# Altium schematic sheet openEPS.SchDoc: OCP EPS Board
size Tabloid; SheetNumber: 1
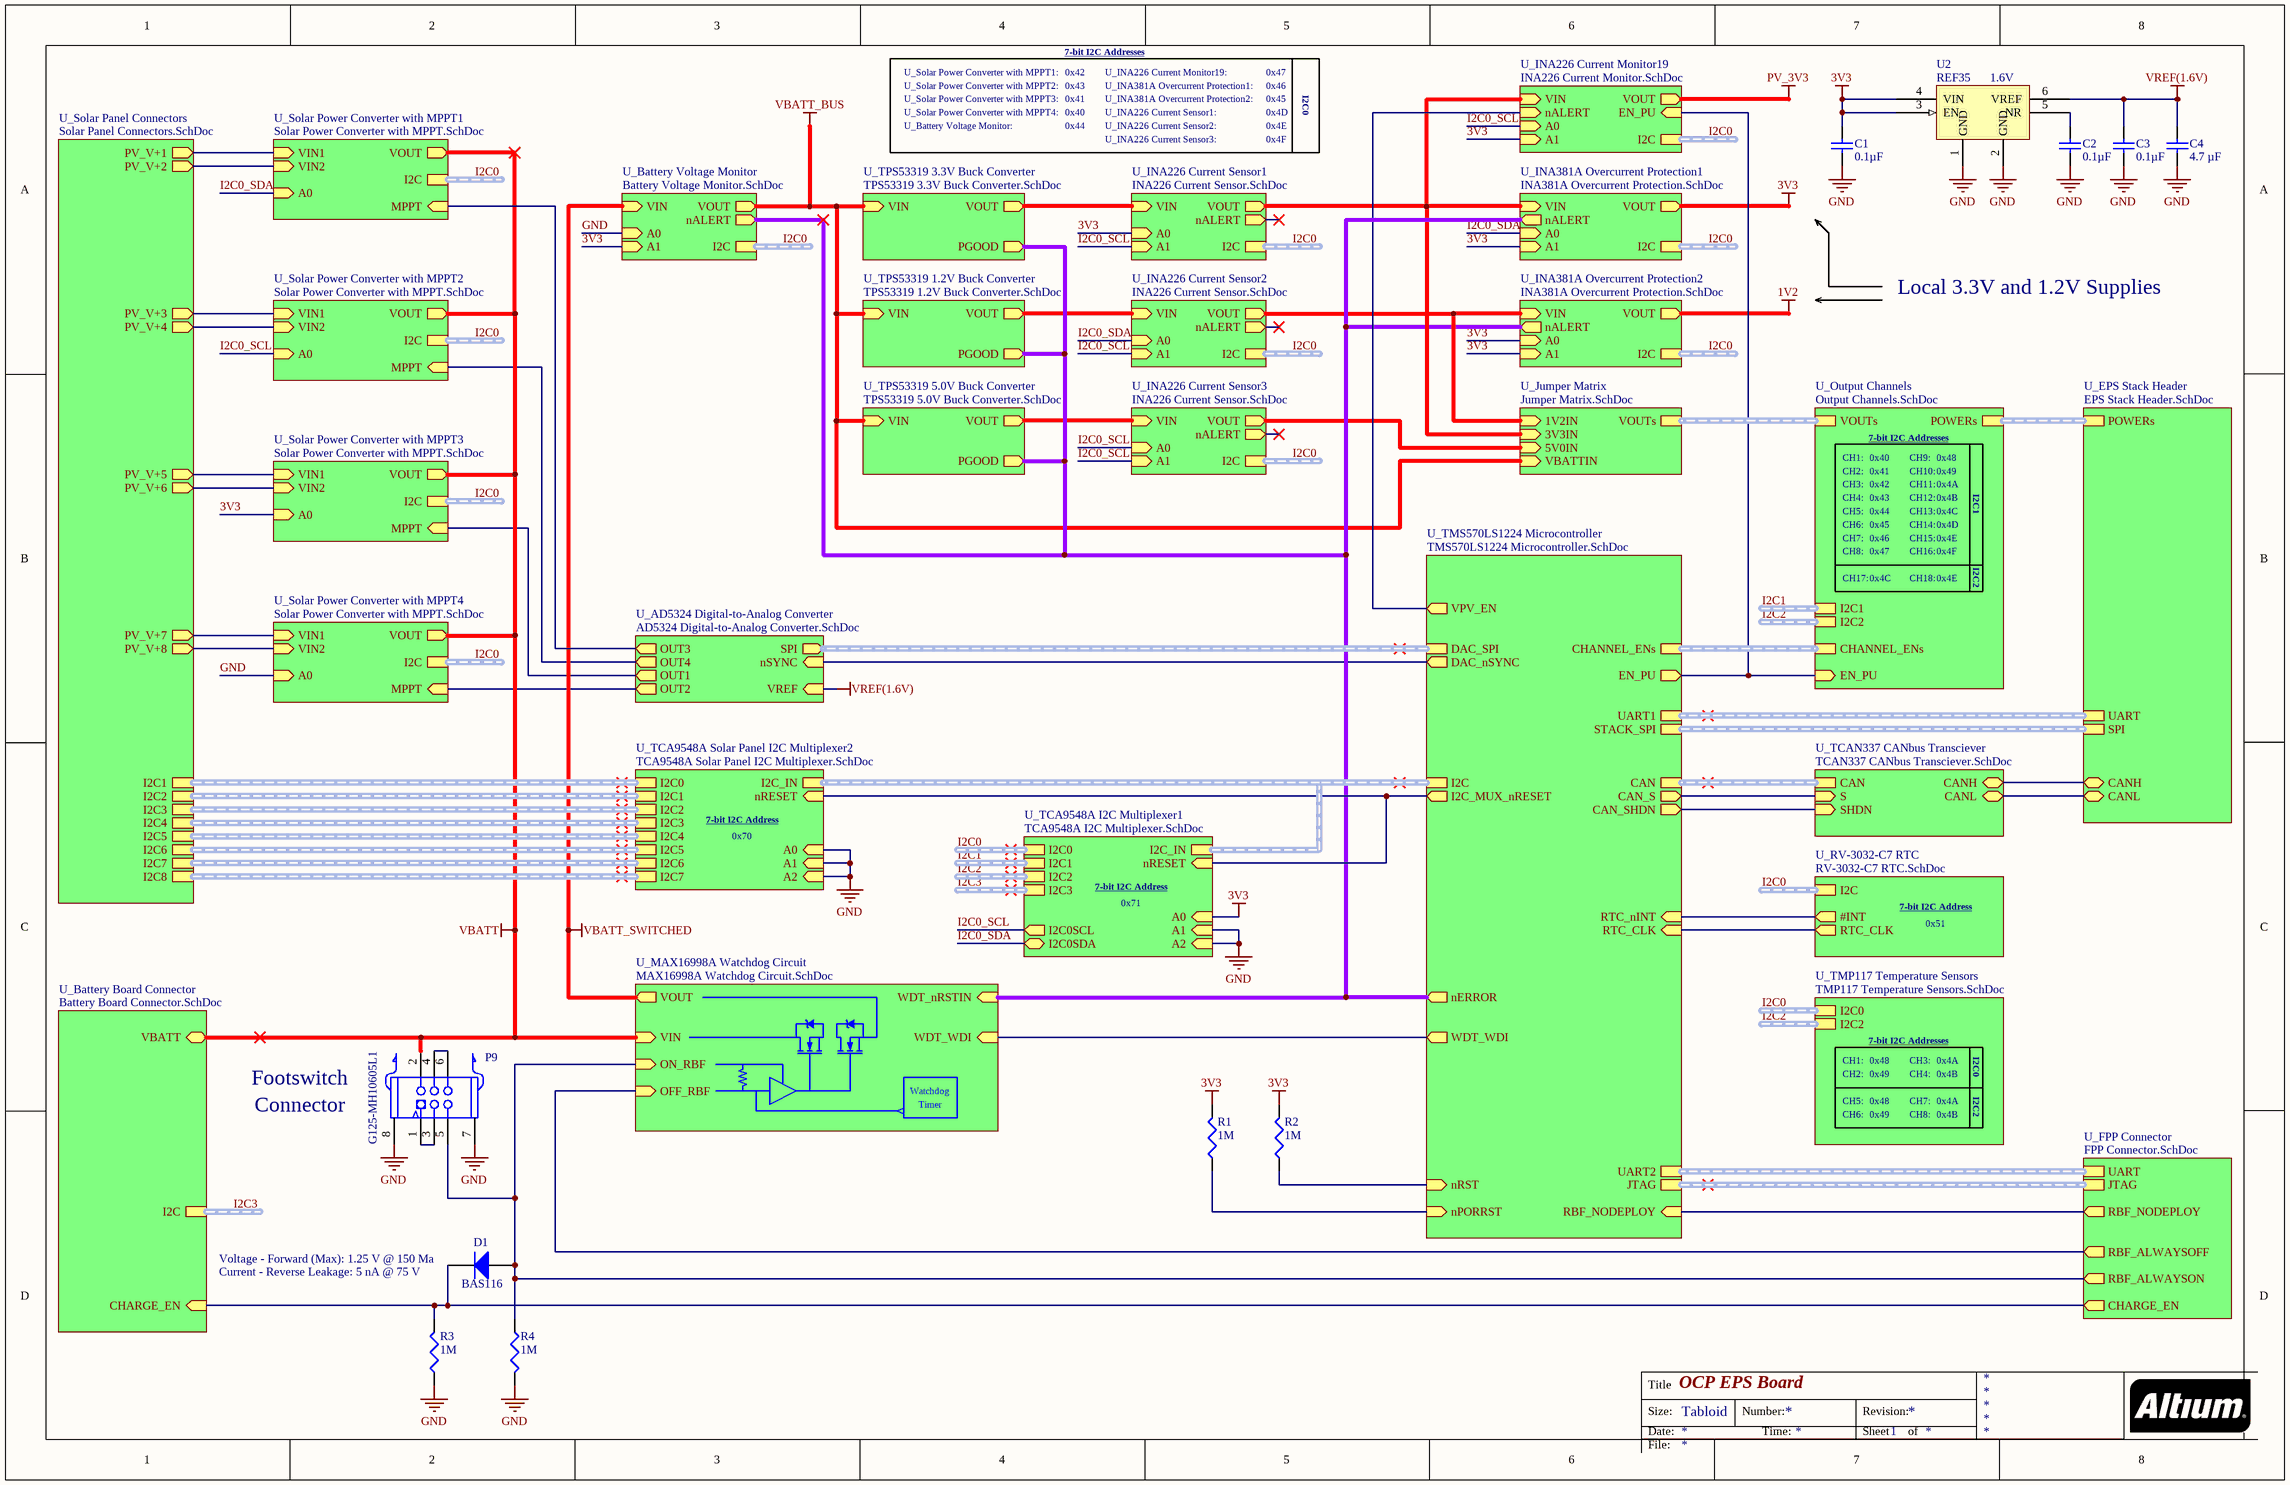
[diagram p0: openEPS.SchDoc]

## Parts
C1  value 0.1µF  [TDK-CGA2B]  (hidden comment: Cap)
C2  value 0.1µF  [TDK-CGA2B]  (hidden comment: Cap)
C3  value 0.1µF  [TDK-CGA2B]  (hidden comment: Cap)
C4  value 4.7 µF  [MUR-GRM188]  (hidden comment: Cap)
D1  BAS116  Voltage - Forward (Max): 1.25 V @ 150 Ma  Current - Reverse Leakage: 5 nA @ 75 V  [DIOD-DFN1006-2]
P9  G125-MH10605L1  [HWN-G125-MH10605L1]
R1  value 1M  [PANA-ERJ2R]  (hidden comment: Res3)
R2  value 1M  [PANA-ERJ2R]  (hidden comment: Res3)
R3  value 1M  [PANA-ERJ2R]  (hidden comment: Res3)
R4  value 1M  [PANA-ERJ2R]  (hidden comment: Res3)
U2  REF35  value 1.6V  [TI-DBV0006A]

## Sub-sheets
U_AD5324 Digital-to-Analog Converter = AD5324 Digital-to-Analog Converter.SchDoc: SPI (out, harness AD5324_SPI), OUT1 (out), OUT2 (out), nSYNC (in), OUT3 (out), OUT4 (out), VREF (in)
U_Battery Board Connector = Battery Board Connector.SchDoc: CHARGE_EN (in), I2C (harness TMS570_I2C1), VBATT (bidir)
U_Battery Voltage Monitor = Battery Voltage Monitor.SchDoc: VIN (in), VOUT (out), I2C (harness INA226_I2C), A0 (in), A1 (in), nALERT (out)
U_EPS Stack Header = EPS Stack Header.SchDoc: CANH (bidir), CANL (bidir), SPI (harness STACK_SPI), UART (harness STACK_UART), POWERs (harness POWERs)
U_FPP Connector = FPP Connector.SchDoc: JTAG (harness DEBUG_JTAG), RBF_ALWAYSON (out), RBF_ALWAYSOFF (out), RBF_NODEPLOY (out), CHARGE_EN (out), UART (harness UART)
U_INA226 Current Monitor19 = INA226 Current Monitor.SchDoc: VIN (in), VOUT (out), I2C (harness I2C), A0 (in), A1 (in), nALERT (in), EN_PU (in)
U_INA226 Current Sensor1 = INA226 Current Sensor.SchDoc: VIN (in), VOUT (out), I2C (harness I2C), A0 (in), A1 (in), nALERT (out)
U_INA226 Current Sensor2 = INA226 Current Sensor.SchDoc: VIN (in), VOUT (out), I2C (harness I2C), A0 (in), A1 (in), nALERT (out)
U_INA226 Current Sensor3 = INA226 Current Sensor.SchDoc: VIN (in), VOUT (out), I2C (harness INA226_I2C), A0 (in), A1 (in), nALERT (out)
U_INA381A Overcurrent Protection1 = INA381A Overcurrent Protection.SchDoc: VIN (in), VOUT (out), I2C (harness I2C), A0 (in), A1 (in), nALERT (out)
U_INA381A Overcurrent Protection2 = INA381A Overcurrent Protection.SchDoc: VIN (in), VOUT (out), I2C (harness INA226_I2C), A0 (in), A1 (in), nALERT (out)
U_Jumper Matrix = Jumper Matrix.SchDoc: 3V3IN (in), VBATTIN (in), 1V2IN (in), 5V0IN (in), VOUTs (harness VOUTs)
U_MAX16998A Watchdog Circuit = MAX16998A Watchdog Circuit.SchDoc: WDT_WDI (in), WDT_nRSTIN (in), ON_RBF (in), VOUT (out), VIN (in), OFF_RBF (in)
U_Output Channels = Output Channels.SchDoc: CHANNEL_ENs (harness CHANNEL_ENs), VOUTs (harness VOUTs), POWERs (harness POWERs), EN_PU (in), I2C2 (harness LTC4316_I2CIN), I2C1 (harness LTC4316_I2CIN)
U_RV-3032-C7 RTC = RV-3032-C7 RTC.SchDoc: #INT (out), I2C (harness RTCMK_I2C), RTC_CLK (out)
U_Solar Panel Connectors = Solar Panel Connectors.SchDoc: PV_V+1 (out), I2C1 (harness PV_I2C1), I2C2 (harness PV_I2C2), I2C3 (harness PV_I2C3), I2C4 (harness PV_I2C4), I2C5 (harness PV_I2C5), I2C6 (harness PV_I2C6), I2C7 (harness PV_I2C7), I2C8 (harness PV_I2C8), PV_V+2 (out), PV_V+3 (out), PV_V+4 (out), PV_V+5 (out), PV_V+6 (out), PV_V+7 (out), PV_V+8 (out)
U_Solar Power Converter with MPPT1 = Solar Power Converter with MPPT.SchDoc: VIN1 (in), VOUT (out), I2C (harness I2C), A0 (in), MPPT (in), VIN2 (in)
U_Solar Power Converter with MPPT2 = Solar Power Converter with MPPT.SchDoc: VIN1 (in), VOUT (out), I2C (harness I2C), A0 (in), MPPT (in), VIN2 (in)
U_Solar Power Converter with MPPT3 = Solar Power Converter with MPPT.SchDoc: VIN1 (in), VOUT (out), I2C (harness I2C), A0 (in), MPPT (in), VIN2 (in)
U_Solar Power Converter with MPPT4 = Solar Power Converter with MPPT.SchDoc: VIN1 (in), VOUT (out), I2C (harness INA3221_I2C), A0 (in), MPPT (in), VIN2 (in)
U_TCA9548A I2C Multiplexer1 = TCA9548A I2C Multiplexer.SchDoc: I2C1 (harness TCA9548A_I2C1), I2C2 (harness TCA9548A_I2C2), I2C3 (harness TCA9548A_I2C3), I2C_IN (harness TCA9548A_I2CIN), I2C0 (harness TCA9548A_I2C0), A0 (in), A1 (in), A2 (in), nRESET (in), I2C0SCL (out), I2C0SDA (bidir)
U_TCA9548A Solar Panel I2C Multiplexer2 = TCA9548A Solar Panel I2C Multiplexer.SchDoc: I2C1 (harness TCA9548A_I2C1), I2C2 (harness TCA9548A_I2C2), I2C3 (harness TCA9548A_I2C3), I2C4 (harness TCA9548A_I2C4), I2C5 (harness TCA9548A_I2C5), I2C6 (harness TCA9548A_I2C6), I2C7 (harness TCA9548A_I2C7), I2C_IN (harness TCA9548A_I2CIN), I2C0 (harness TCA9548A_I2C0), A0 (in), A1 (in), A2 (in), nRESET (in)
U_TCAN337 CANbus Transciever = TCAN337 CANbus Transciever.SchDoc: CANH (bidir), CANL (bidir), CAN (harness TCAN337_CAN), S (in), SHDN (in)
U_TMP117 Temperature Sensors = TMP117 Temperature Sensors.SchDoc: I2C0 (harness TCA9548A_I2CIN), I2C2 (harness TCA9548A_I2CIN)
U_TMS570LS1224 Microcontroller = TMS570LS1224 Microcontroller.SchDoc: nERROR (out), JTAG (harness TMS570_JTAG), CHANNEL_ENs (harness CHANNEL_ENs), DAC_nSYNC (out), WDT_WDI (out), VPV_EN (out), RTC_nINT (in), I2C (harness I2C), UART1 (harness UART), CAN (harness CAN), STACK_SPI (harness STACK_SPI), DAC_SPI (harness DAC_SPI), nRST (in), RTC_CLK (in), CAN_SHDN (out), CAN_S (out), nPORRST (in), RBF_NODEPLOY (in), EN_PU (out), UART2 (harness UART), I2C_MUX_nRESET (out)
U_TPS53319 1.2V Buck Converter = TPS53319 1.2V Buck Converter.SchDoc: VIN (in), VOUT (out), PGOOD (out)
U_TPS53319 3.3V Buck Converter = TPS53319 3.3V Buck Converter.SchDoc: VIN (in), VOUT (out), PGOOD (out)
U_TPS53319 5.0V Buck Converter = TPS53319 5.0V Buck Converter.SchDoc: VIN (in), VOUT (out), PGOOD (out)

## Nets
1V2: sheet U_INA381A Overcurrent Protection2/VOUT
3V3: C1.1 R1.1 R2.1 U2.3(EN) U2.4(VIN) ; sheet U_INA381A Overcurrent Protection2/A0, sheet U_INA381A Overcurrent Protection2/A1, sheet U_INA381A Overcurrent Protection1/VOUT, sheet U_INA381A Overcurrent Protection1/A1, sheet U_INA226 Current Monitor19/A1, sheet U_INA226 Current Sensor1/A0, sheet U_Solar Power Converter with MPPT3/A0, sheet U_Battery Voltage Monitor/A1, sheet U_TCA9548A I2C Multiplexer1/A0
GND: C1.2 C2.2 C3.2 C4.1 P9.7 P9.8 R3.1 R4.2 U2.1(GND) U2.2(GND) ; sheet U_TCA9548A Solar Panel I2C Multiplexer2/A0, sheet U_TCA9548A Solar Panel I2C Multiplexer2/A1, sheet U_TCA9548A Solar Panel I2C Multiplexer2/A2, sheet U_Solar Power Converter with MPPT4/A0, sheet U_Battery Voltage Monitor/A0, sheet U_TCA9548A I2C Multiplexer1/A1, sheet U_TCA9548A I2C Multiplexer1/A2
PV_3V3: sheet U_INA226 Current Monitor19/VOUT
VBATT: P9.2 ; sheet U_MAX16998A Watchdog Circuit/VIN, sheet U_Solar Power Converter with MPPT1/VOUT, sheet U_Solar Power Converter with MPPT2/VOUT, sheet U_Solar Power Converter with MPPT3/VOUT, sheet U_Solar Power Converter with MPPT4/VOUT, sheet U_Battery Board Connector/VBATT
VBATT_BUS: sheet U_Jumper Matrix/VBATTIN, sheet U_TPS53319 1.2V Buck Converter/VIN, sheet U_TPS53319 3.3V Buck Converter/VIN, sheet U_TPS53319 5.0V Buck Converter/VIN, sheet U_Battery Voltage Monitor/VOUT
VBATT_SWITCHED: sheet U_MAX16998A Watchdog Circuit/VOUT, sheet U_Battery Voltage Monitor/VIN
VREF(1.6V): C3.1 C4.2 U2.6(VREF) ; sheet U_AD5324 Digital-to-Analog Converter/VREF
I2C0_SCL: sheet U_INA226 Current Monitor19/A0, sheet U_INA226 Current Sensor1/A1, sheet U_INA226 Current Sensor2/A1, sheet U_INA226 Current Sensor3/A0, sheet U_INA226 Current Sensor3/A1, sheet U_Solar Power Converter with MPPT2/A0, sheet U_TCA9548A I2C Multiplexer1/I2C0SCL
I2C0_SDA: sheet U_INA381A Overcurrent Protection1/A0, sheet U_INA226 Current Sensor2/A0, sheet U_Solar Power Converter with MPPT1/A0, sheet U_TCA9548A I2C Multiplexer1/I2C0SDA
NetC2_1: C2.1 U2.5(NR)
NetD1_1: D1.1(A) P9.5 R4.1 ; sheet U_MAX16998A Watchdog Circuit/ON_RBF, sheet U_FPP Connector/RBF_ALWAYSON
NetD1_2: D1.2(K) R3.2 ; sheet U_FPP Connector/CHARGE_EN, sheet U_Battery Board Connector/CHARGE_EN
NetP9_1: P9.1 P9.3
NetP9_4: P9.4 P9.6
NetR1_2: R1.2 ; sheet U_TMS570LS1224 Microcontroller/nPORRST
NetR2_2: R2.2 ; sheet U_TMS570LS1224 Microcontroller/nRST
(unnamed): sheet U_Output Channels/EN_PU, sheet U_INA226 Current Monitor19/EN_PU, sheet U_TMS570LS1224 Microcontroller/EN_PU
(unnamed): sheet U_Jumper Matrix/3V3IN, sheet U_INA381A Overcurrent Protection1/VIN, sheet U_INA226 Current Monitor19/VIN, sheet U_INA226 Current Sensor1/VOUT
(unnamed): sheet U_Jumper Matrix/1V2IN, sheet U_INA381A Overcurrent Protection2/VIN, sheet U_INA226 Current Sensor2/VOUT
(unnamed): sheet U_Jumper Matrix/5V0IN, sheet U_INA226 Current Sensor3/VOUT
(unnamed): sheet U_TCAN337 CANbus Transciever/CANH, sheet U_EPS Stack Header/CANH
(unnamed): sheet U_TCAN337 CANbus Transciever/CANL, sheet U_EPS Stack Header/CANL
(unnamed): sheet U_TCAN337 CANbus Transciever/S, sheet U_TMS570LS1224 Microcontroller/CAN_S
(unnamed): sheet U_TCAN337 CANbus Transciever/SHDN, sheet U_TMS570LS1224 Microcontroller/CAN_SHDN
(unnamed): sheet U_INA381A Overcurrent Protection2/nALERT, sheet U_INA381A Overcurrent Protection1/nALERT, sheet U_TPS53319 1.2V Buck Converter/PGOOD, sheet U_TPS53319 3.3V Buck Converter/PGOOD, sheet U_TPS53319 5.0V Buck Converter/PGOOD, sheet U_MAX16998A Watchdog Circuit/WDT_nRSTIN, sheet U_TMS570LS1224 Microcontroller/nERROR, sheet U_Battery Voltage Monitor/nALERT
(unnamed): sheet U_INA226 Current Monitor19/nALERT, sheet U_TMS570LS1224 Microcontroller/VPV_EN
(unnamed): sheet U_AD5324 Digital-to-Analog Converter/OUT1, sheet U_Solar Power Converter with MPPT3/MPPT
(unnamed): sheet U_AD5324 Digital-to-Analog Converter/OUT2, sheet U_Solar Power Converter with MPPT4/MPPT
(unnamed): sheet U_AD5324 Digital-to-Analog Converter/nSYNC, sheet U_TMS570LS1224 Microcontroller/DAC_nSYNC
(unnamed): sheet U_AD5324 Digital-to-Analog Converter/OUT3, sheet U_Solar Power Converter with MPPT1/MPPT
(unnamed): sheet U_AD5324 Digital-to-Analog Converter/OUT4, sheet U_Solar Power Converter with MPPT2/MPPT
(unnamed): sheet U_TPS53319 1.2V Buck Converter/VOUT, sheet U_INA226 Current Sensor2/VIN
(unnamed): sheet U_TPS53319 3.3V Buck Converter/VOUT, sheet U_INA226 Current Sensor1/VIN
(unnamed): sheet U_TPS53319 5.0V Buck Converter/VOUT, sheet U_INA226 Current Sensor3/VIN
(unnamed): sheet U_MAX16998A Watchdog Circuit/WDT_WDI, sheet U_TMS570LS1224 Microcontroller/WDT_WDI
(unnamed): sheet U_MAX16998A Watchdog Circuit/OFF_RBF, sheet U_FPP Connector/RBF_ALWAYSOFF
(unnamed): sheet U_RV-3032-C7 RTC/#INT, sheet U_TMS570LS1224 Microcontroller/RTC_nINT
(unnamed): sheet U_RV-3032-C7 RTC/RTC_CLK, sheet U_TMS570LS1224 Microcontroller/RTC_CLK
(unnamed): sheet U_TCA9548A Solar Panel I2C Multiplexer2/nRESET, sheet U_TMS570LS1224 Microcontroller/I2C_MUX_nRESET, sheet U_TCA9548A I2C Multiplexer1/nRESET
(unnamed): sheet U_Solar Panel Connectors/PV_V+1, sheet U_Solar Power Converter with MPPT1/VIN1
(unnamed): sheet U_Solar Panel Connectors/PV_V+2, sheet U_Solar Power Converter with MPPT1/VIN2
(unnamed): sheet U_Solar Panel Connectors/PV_V+3, sheet U_Solar Power Converter with MPPT2/VIN1
(unnamed): sheet U_Solar Panel Connectors/PV_V+4, sheet U_Solar Power Converter with MPPT2/VIN2
(unnamed): sheet U_Solar Panel Connectors/PV_V+5, sheet U_Solar Power Converter with MPPT3/VIN1
(unnamed): sheet U_Solar Panel Connectors/PV_V+6, sheet U_Solar Power Converter with MPPT3/VIN2
(unnamed): sheet U_Solar Panel Connectors/PV_V+7, sheet U_Solar Power Converter with MPPT4/VIN1
(unnamed): sheet U_Solar Panel Connectors/PV_V+8, sheet U_Solar Power Converter with MPPT4/VIN2
(unnamed): sheet U_TMS570LS1224 Microcontroller/RBF_NODEPLOY, sheet U_FPP Connector/RBF_NODEPLOY

## Buses and harness runs
harness I2C0 = sheet U_Battery Voltage Monitor/I2C
harness I2C0 = sheet U_INA226 Current Monitor19/I2C
harness I2C0 = sheet U_INA226 Current Sensor1/I2C
harness I2C0 = sheet U_INA226 Current Sensor2/I2C
harness I2C0 = sheet U_INA226 Current Sensor3/I2C
harness I2C0 = sheet U_INA381A Overcurrent Protection1/I2C
harness I2C0 = sheet U_INA381A Overcurrent Protection2/I2C
harness I2C0 = sheet U_RV-3032-C7 RTC/I2C
harness I2C0 = sheet U_Solar Power Converter with MPPT1/I2C
harness I2C0 = sheet U_Solar Power Converter with MPPT2/I2C
harness I2C0 = sheet U_Solar Power Converter with MPPT3/I2C
harness I2C0 = sheet U_Solar Power Converter with MPPT4/I2C
harness I2C0 = sheet U_TCA9548A I2C Multiplexer1/I2C0
harness I2C0 = sheet U_TMP117 Temperature Sensors/I2C0
harness I2C1 = sheet U_Output Channels/I2C1
harness I2C1 = sheet U_TCA9548A I2C Multiplexer1/I2C1
harness I2C2 = sheet U_Output Channels/I2C2
harness I2C2 = sheet U_TCA9548A I2C Multiplexer1/I2C2
harness I2C2 = sheet U_TMP117 Temperature Sensors/I2C2
harness I2C3 = sheet U_Battery Board Connector/I2C
harness I2C3 = sheet U_TCA9548A I2C Multiplexer1/I2C3
harness sheet U_AD5324 Digital-to-Analog Converter/SPI = sheet U_TMS570LS1224 Microcontroller/DAC_SPI
harness sheet U_EPS Stack Header/POWERs = sheet U_Output Channels/POWERs
harness sheet U_EPS Stack Header/SPI = sheet U_TMS570LS1224 Microcontroller/STACK_SPI
harness sheet U_EPS Stack Header/UART = sheet U_TMS570LS1224 Microcontroller/UART1
harness sheet U_FPP Connector/JTAG = sheet U_TMS570LS1224 Microcontroller/JTAG
harness sheet U_FPP Connector/UART = sheet U_TMS570LS1224 Microcontroller/UART2
harness sheet U_Jumper Matrix/VOUTs = sheet U_Output Channels/VOUTs
harness sheet U_Output Channels/CHANNEL_ENs = sheet U_TMS570LS1224 Microcontroller/CHANNEL_ENs
harness sheet U_Solar Panel Connectors/I2C1 = sheet U_TCA9548A Solar Panel I2C Multiplexer2/I2C0
harness sheet U_Solar Panel Connectors/I2C2 = sheet U_TCA9548A Solar Panel I2C Multiplexer2/I2C1
harness sheet U_Solar Panel Connectors/I2C3 = sheet U_TCA9548A Solar Panel I2C Multiplexer2/I2C2
harness sheet U_Solar Panel Connectors/I2C4 = sheet U_TCA9548A Solar Panel I2C Multiplexer2/I2C3
harness sheet U_Solar Panel Connectors/I2C5 = sheet U_TCA9548A Solar Panel I2C Multiplexer2/I2C4
harness sheet U_Solar Panel Connectors/I2C6 = sheet U_TCA9548A Solar Panel I2C Multiplexer2/I2C5
harness sheet U_Solar Panel Connectors/I2C7 = sheet U_TCA9548A Solar Panel I2C Multiplexer2/I2C6
harness sheet U_Solar Panel Connectors/I2C8 = sheet U_TCA9548A Solar Panel I2C Multiplexer2/I2C7
harness sheet U_TCA9548A I2C Multiplexer1/I2C_IN = sheet U_TCA9548A Solar Panel I2C Multiplexer2/I2C_IN = sheet U_TMS570LS1224 Microcontroller/I2C
harness sheet U_TCAN337 CANbus Transciever/CAN = sheet U_TMS570LS1224 Microcontroller/CAN

## Notes on the sheet
- U_Solar Power Converter with MPPT1:
- U_Solar Power Converter with MPPT2:
- U_Solar Power Converter with MPPT3:
- 0x41
- 0x42
- 0x43
- 7-bit I2C Addresses
- U_INA226 Current Monitor19:
- U_INA381A Overcurrent Protection1:
- U_INA381A Overcurrent Protection2:
- 0x47
- 0x46
- 0x45
- U_Solar Power Converter with MPPT4:
- U_Battery Voltage Monitor:
- 0x40
- 0x44
- U_INA226 Current Sensor1:
- U_INA226 Current Sensor2:
- U_INA226 Current Sensor3:
- 0x4F
- 0x4E
- 0x4D
- I2C0
- Local 3.3V and 1.2V Supplies
- CH1:
- CH2:
- CH3:
- CH4:
- CH9:
- CH10:
- CH11:
- CH12:
- 0x48
- 0x49
- 0x4A
- 0x4B
- I2C1
- CH5:
- CH6:
- CH7:
- CH8:
- CH13:
- CH14:
- CH15:
- CH16:
- 0x4C
- CH17:
- CH18:
- I2C2
- 7-bit I2C Address
- 0x70
- 0x71
- 0x51
- (near P9) Footswitch
- Watchdog
- Timer
- (near P9) Connector
- Title
- Size:
- Date:
- Tabloid
- Number:
- Time:
- Revision:
- Sheet
- of
- File:

## Library data of the parts
C1-C3 = PC-TDK-02259: CAP CER 0.1UF 50V X7R 0402; Manufacturer Part Number: CGA2B3X7R1H104K050BB; Index: 2259; Designator: C?; Tolerance: ±10%; Published: 2016-03-16; LatestRevisionDate: 2016-03-16; LatestRevisionNote: ...; PackageReference: 0402 (1005 Metric); Publisher: AlbertaSat; PackageDescription: Radial Cap, Thru-Hole; 2 Leads; 0.3 in Pin Spacing; Part Number: PC-TDK-02259; Supplier Part Number 1: 445-6899-1-ND; Supplier 1: Digi-key; Supplier Link: http://www.digikey.ca/product-search/en?keywords=445-6899-1-ND; Voltage - Rated: 50V; Temperature Coefficient: X7R; Applications: Automotive; Operating Temperature: -55°C ~ 125°C
C4 = 10165: CAP CER 4.7UF 16V X7R 0603; Part Number: 10165; Manufacturer Part Number: GRM188Z71C475KE21D; Designator: C?; Tolerance: ±10%; Voltage - Rated: 25V; Published: 8-Jun-2000; LatestRevisionDate: 17-Jul-2002; LatestRevisionNote: Re-released for DXP Platform.; PackageReference: 0603 (1608 Metric); Publisher: Altium Limited; PackageDescription: Chip Capacitor, 2-Leads, Body 1.60x0.80mm, IPC Low Density; Supplier Part Number 1: 490-GRM188Z71C475KE21DCT-ND; Supplier 1: Digi-Key; Supplier Link: #https://www.digikey.ca/en/products/detail/murata-electronics/GRM188Z71C475KE21D/13401930#; Temperature Coefficient: X7R; Application: General Purpose; Operating Temperature: -55°C ~ 125°C; Supplier 2: Mouser; Supplier Part Number 2: 81-GRM188Z71C475KE1D
D1 = 61: DIODE GEN PURP 85V 215MA 2DFN; Part Number: 61; Manufacturer Part Number: BAS116LPH4-7B; Designator: d?; Power - Peak Pulse: 300 mW; Published: 8-Jun-2000; LatestRevisionDate: 17-Jul-2002; LatestRevisionNote: Re-released for DXP Platform.; PackageVersion: Sep-1996; PackageReference: DFN1006; Publisher: Altium Limited; PackageDescription: DO-214-AB/SMC; 2 C-Bend Leads; Body 7.9 x 5.9 mm, inc. leads (LxW); Code_JEDEC: DO-214-AB; Supplier Part Number 1: BAS116LPH4-7BDICT-ND; Supplier 1: Digi-Key; Supplier Part Number 2: 621-BAS116LPH4-7B; Supplier 2: Mouser; Supplier Link: #https://www.digikey.ca/en/products/detail/diodes-incorporated/BAS116LPH4-7B/2755852#; Voltage - Breakdown (Min): 85V; Operating Temperature: -55°C ~ 150°C (TJ)
P9 = PP-HWN-00014: CONN HEADER R/A 6POS 1.25MM; Index: 14; Designator: P?; Part Number: PP-HWN-00014; Manufacturer Part Number: G125-MH10605L1P; Supplier Part Number 1: 952-2695-ND; Supplier 1: Digi-key; Supplier Part Number 2: 855-G125-MH10605L1P; Supplier 2: Mouser; Publisher: AlbertaSat; Published: 2019-07-08; LatestRevisionDate: 2023-05-04; LatestRevisionNote: Added operating temperature; Supplier Link: https://www.digikey.ca/products/en?keywords=952-2695-ND; Operating Temperature: -65°C ~ 150°C
R1-R4 = 19704: RES SMD 1M OHM 1% 1/10W 0402; Part Number: 19704; Manufacturer Part Number: ERJ-2RKF1004X; Designator: R?; Power: 0.1W, 1/10W; Temperature Coefficient: ±100ppm/°C; Published: 8-Jun-2000; LatestRevisionDate: 29-May-2009; LatestRevisionNote: IPC-7351 Footprint Added.; PackageReference: 0402 (1005 Metric); Publisher: Altium Limited; PackageDescription: Chip Resistor, 2-Leads, Body 1.00x0.50mm, IPC Low Density; Supplier Part Number 1: P1.00MLCT-ND; Supplier 1: Digi-Key; Supplier Link: http://www.digikey.ca/product-search/en?keywords=P1.00MLCT-ND; Tolerance: ±1%; Operating Temperature: -55°C ~ 155°C
U2 = 150: 650-NA QUIESCENT CURRENT, 12-PPM; Part Number: 150; Manufacturer Part Number: REF35160QDBVR; Designator: U?; Supplier Part Number 2: 595-REF35160QDBVR; Supplier 2: Mouser; Supplier Part Number 1: 296-REF35160QDBVRCT-ND; Supplier 1: Digi-Key; Supplier Link: https://www.digikey.ca/products/en?keywords=296-REF35160QDBVRCT-ND; PackageReference: SOT-23-6; Operating Temperature: -40°C ~ 125°C (TA)